# EAGLE schematic HotFire_BreakoutBoard (EAGLE 9.0.1)
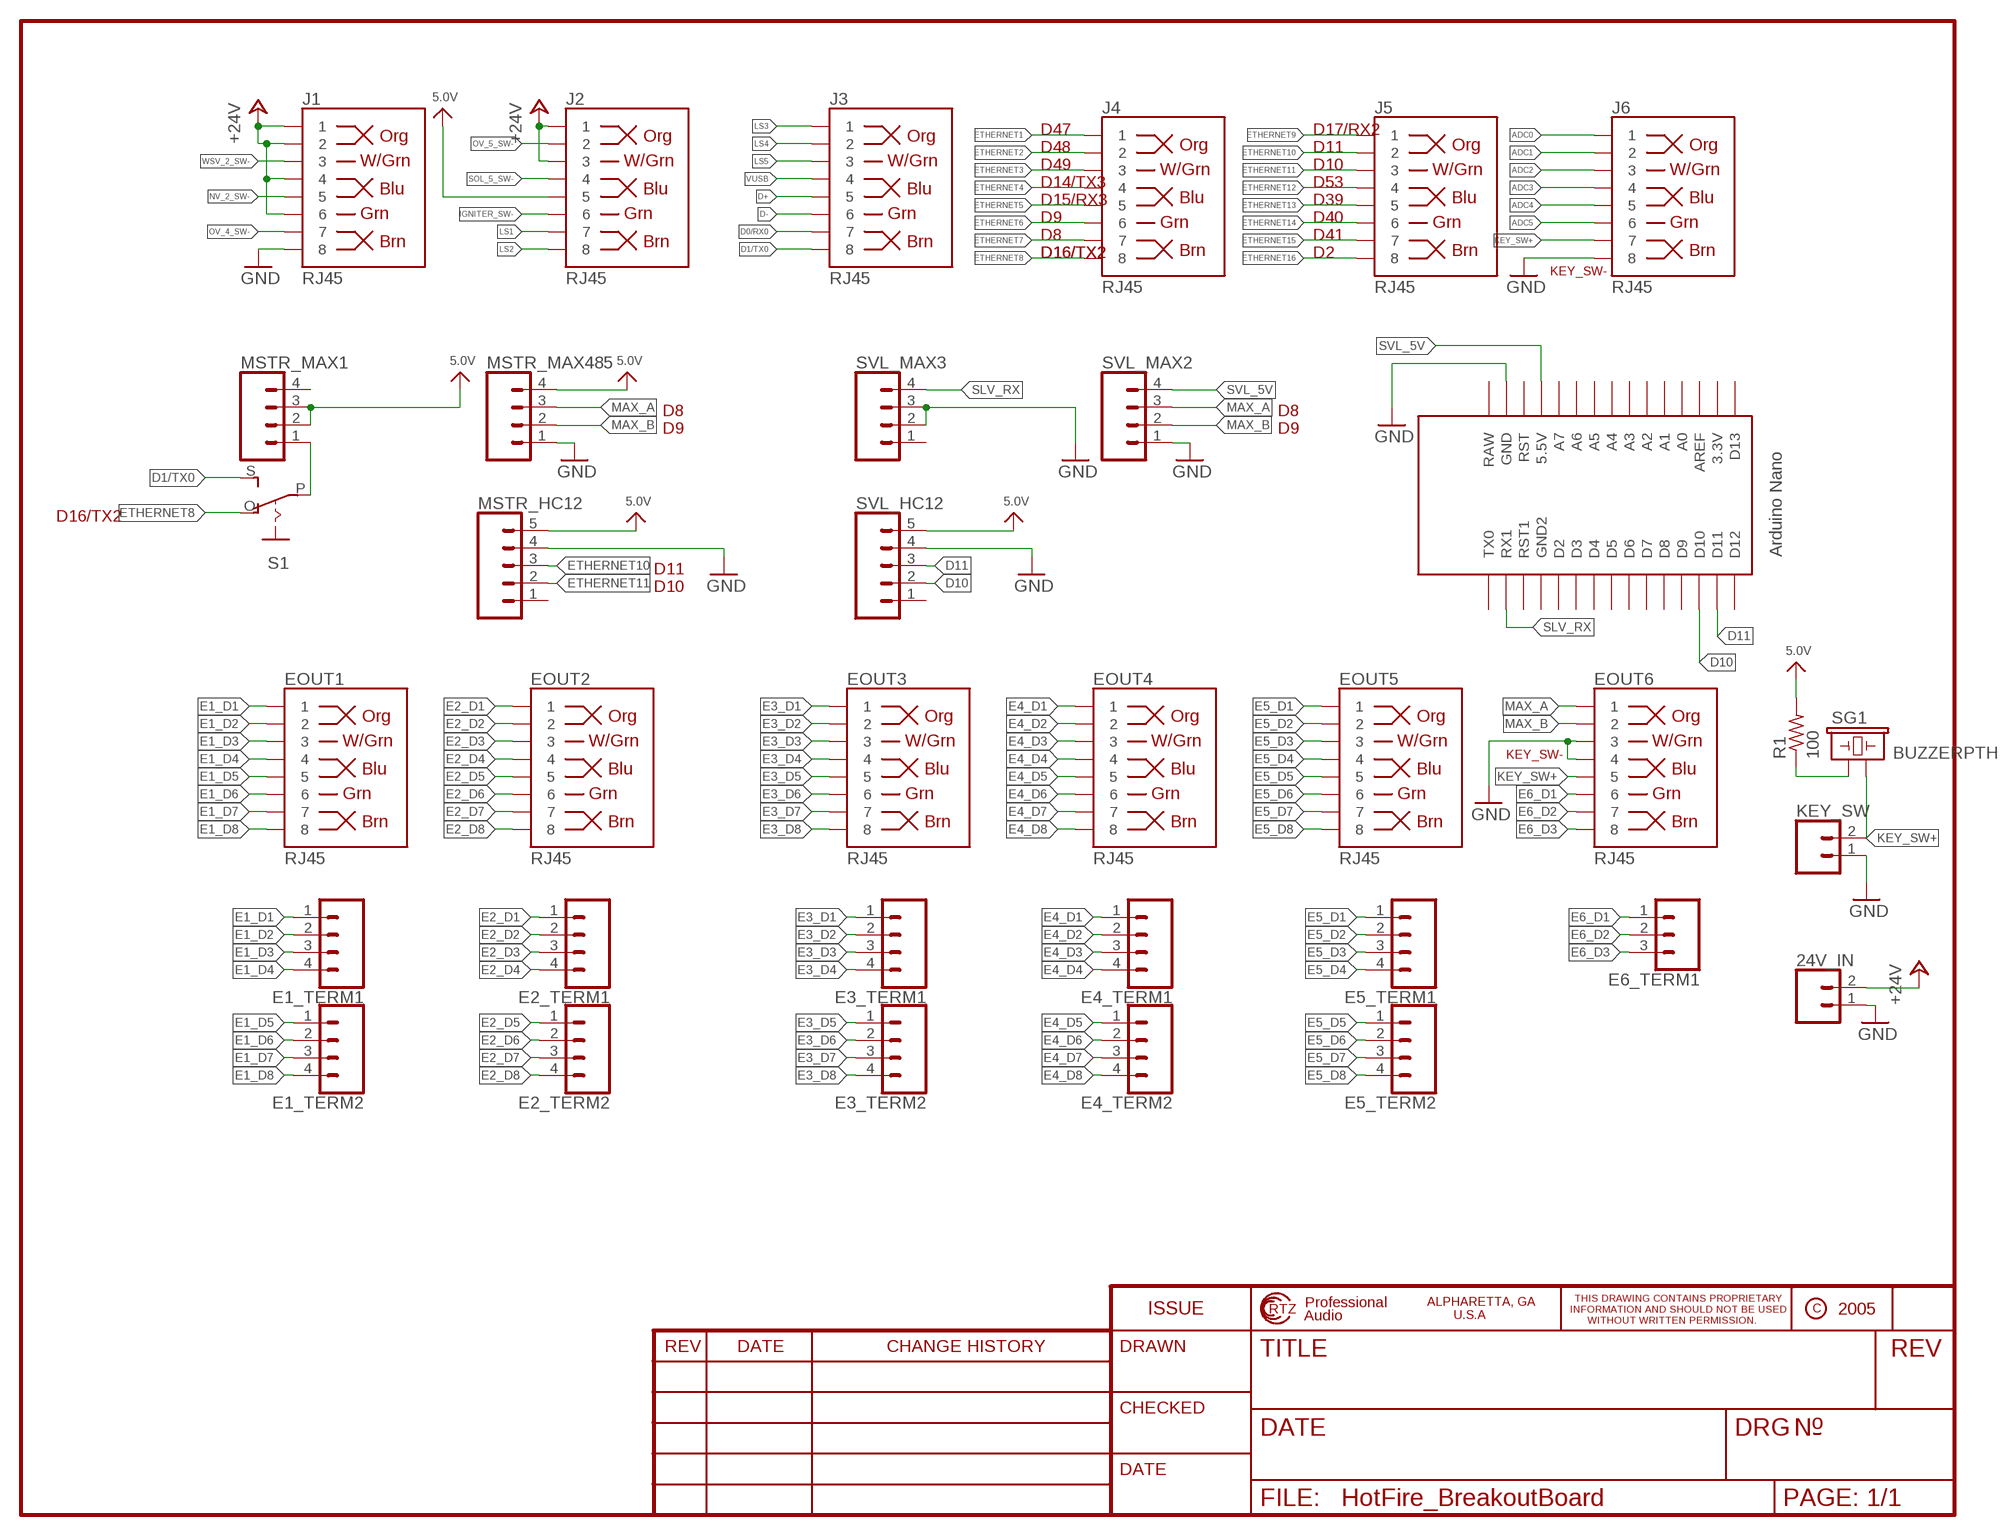
[diagram p0: schematic, sheet 1]

## Parts
24V_IN  CONN_023.5MM  [SCREWTERMINAL-3.5MM-2]
E1_TERM1  CONN_04SCREW  [SCREWTERMINAL-3.5MM-4]
E1_TERM2  CONN_04SCREW  [SCREWTERMINAL-3.5MM-4]
E2_TERM1  CONN_04SCREW  [SCREWTERMINAL-3.5MM-4]
E2_TERM2  CONN_04SCREW  [SCREWTERMINAL-3.5MM-4]
E3_TERM1  CONN_04SCREW  [SCREWTERMINAL-3.5MM-4]
E3_TERM2  CONN_04SCREW  [SCREWTERMINAL-3.5MM-4]
E4_TERM1  CONN_04SCREW  [SCREWTERMINAL-3.5MM-4]
E4_TERM2  CONN_04SCREW  [SCREWTERMINAL-3.5MM-4]
E5_TERM1  CONN_04SCREW  [SCREWTERMINAL-3.5MM-4]
E5_TERM2  CONN_04SCREW  [SCREWTERMINAL-3.5MM-4]
E6_TERM1  CONN_03SCREW  [SCREWTERMINAL-3.5MM-3]
EOUT1  RJ45  RJ45-8  [RJ45-8]
EOUT2  RJ45  RJ45-8  [RJ45-8]
EOUT3  RJ45  RJ45-8  [RJ45-8]
EOUT4  RJ45  RJ45-8  [RJ45-8]
EOUT5  RJ45  RJ45-8  [RJ45-8]
EOUT6  RJ45  RJ45-8  [RJ45-8]
J1  RJ45  RJ45-8  [RJ45-8]
J2  RJ45  RJ45-8  [RJ45-8]
J3  RJ45  RJ45-8  [RJ45-8]
J4  RJ45  RJ45-8  [RJ45-8]
J5  RJ45  RJ45-8  [RJ45-8]
J6  RJ45  RJ45-8  [RJ45-8]
KEY_SW  CONN_023.5MM  [SCREWTERMINAL-3.5MM-2]
MSTR_HC12  CONN_05  [1X05]
MSTR_MAX1  CONN_04  [1X04]
MSTR_MAX485  CONN_04  [1X04]
R1  100  R-US_R0805  [R0805]
S1  EG1218S  [EG1218]
SG1  BUZZERPTH  [BUZZER-12MM]
SVL_HC12  CONN_05  [1X05]
SVL_MAX2  CONN_04  [1X04]
SVL_MAX3  CONN_04  [1X04]
U$4  NANO  [NANO]

## Nets
5.0V [16mil]: J2.5 MSTR_HC12.5 MSTR_MAX1.2 MSTR_MAX1.3 MSTR_MAX485.4 R1.2 SVL_HC12.5
+24V [24mil]: 24V_IN.2 J1.1 J1.2 J1.4 J1.6 J2.1 J2.3
ADC0: J6.1
ADC1: J6.2
ADC2: J6.3
ADC3: J6.4
ADC4: J6.5
ADC5: J6.6
D0/RX0: J3.7
D1/TX0: J3.8 S1.S
D10: SVL_HC12.2 U$4.D10
D11: SVL_HC12.3 U$4.D11
D+: J3.5
D-: J3.6
E1_D1: E1_TERM1.1 EOUT1.1
E1_D2: E1_TERM1.2 EOUT1.2
E1_D3: E1_TERM1.3 EOUT1.3
E1_D4: E1_TERM1.4 EOUT1.4
E1_D5: E1_TERM2.1 EOUT1.5
E1_D6: E1_TERM2.2 EOUT1.6
E1_D7: E1_TERM2.3 EOUT1.7
E1_D8: E1_TERM2.4 EOUT1.8
E2_D1: E2_TERM1.1 EOUT2.1
E2_D2: E2_TERM1.2 EOUT2.2
E2_D3: E2_TERM1.3 EOUT2.3
E2_D4: E2_TERM1.4 EOUT2.4
E2_D5: E2_TERM2.1 EOUT2.5
E2_D6: E2_TERM2.2 EOUT2.6
E2_D7: E2_TERM2.3 EOUT2.7
E2_D8: E2_TERM2.4 EOUT2.8
E3_D1: E3_TERM1.1 EOUT3.1
E3_D2: E3_TERM1.2 EOUT3.2
E3_D3: E3_TERM1.3 EOUT3.3
E3_D4: E3_TERM1.4 EOUT3.4
E3_D5: E3_TERM2.1 EOUT3.5
E3_D6: E3_TERM2.2 EOUT3.6
E3_D7: E3_TERM2.3 EOUT3.7
E3_D8: E3_TERM2.4 EOUT3.8
E4_D1: E4_TERM1.1 EOUT4.1
E4_D2: E4_TERM1.2 EOUT4.2
E4_D3: E4_TERM1.3 EOUT4.3
E4_D4: E4_TERM1.4 EOUT4.4
E4_D5: E4_TERM2.1 EOUT4.5
E4_D6: E4_TERM2.2 EOUT4.6
E4_D7: E4_TERM2.3 EOUT4.7
E4_D8: E4_TERM2.4 EOUT4.8
E5_D1: E5_TERM1.1 EOUT5.1
E5_D2: E5_TERM1.2 EOUT5.2
E5_D3: E5_TERM1.3 EOUT5.3
E5_D4: E5_TERM1.4 EOUT5.4
E5_D5: E5_TERM2.1 EOUT5.5
E5_D6: E5_TERM2.2 EOUT5.6
E5_D7: E5_TERM2.3 EOUT5.7
E5_D8: E5_TERM2.4 EOUT5.8
E6_D1: E6_TERM1.1 EOUT6.6
E6_D2: E6_TERM1.2 EOUT6.7
E6_D3: E6_TERM1.3 EOUT6.8
ETHERNET1: J4.1
ETHERNET2: J4.2
ETHERNET3: J4.3
ETHERNET4: J4.4
ETHERNET5: J4.5
ETHERNET6: J4.6
ETHERNET7: J4.7
ETHERNET8: J4.8 S1.O
ETHERNET9: J5.1
ETHERNET10: J5.2 MSTR_HC12.3
ETHERNET11: J5.3 MSTR_HC12.2
ETHERNET12: J5.4
ETHERNET13: J5.5
ETHERNET14: J5.6
ETHERNET15: J5.7
ETHERNET16: J5.8
GND [32mil]: 24V_IN.1 EOUT6.3 EOUT6.4 J1.8 J6.8 KEY_SW.1 MSTR_HC12.4 MSTR_MAX485.1 SVL_HC12.4 SVL_MAX2.1 SVL_MAX3.2 SVL_MAX3.3 U$4.GND
IGNITER_SW- [32mil]: J2.6
KEY_SW+ [32mil]: EOUT6.5 J6.7 KEY_SW.2 SG1.-
LS1: J2.7
LS2: J2.8
LS3: J3.1
LS4: J3.2
LS5: J3.3
MAX_A: EOUT6.1 MSTR_MAX485.3 SVL_MAX2.3
MAX_B: EOUT6.2 MSTR_MAX485.2 SVL_MAX2.2
N$1: MSTR_MAX1.1 S1.P
N$5 [16mil]: R1.1 SG1.+
NV_2_SW- [24mil]: J1.5
OV_4_SW- [24mil]: J1.7
OV_5_SW- [24mil]: J2.2
SLV_RX: SVL_MAX3.4 U$4.RX1
SOL_5_SW- [24mil]: J2.4
SVL_5V: SVL_MAX2.4 U$4.5V(5.5V)
VUSB [16mil]: J3.4
WSV_2_SW- [24mil]: J1.3
Unconnected: MSTR_HC12.1 MSTR_MAX1.4 SVL_HC12.1 SVL_MAX3.1 U$4.3.3V U$4.A0 U$4.A1 U$4.A2 U$4.A3 U$4.A4 U$4.A5 U$4.A6 U$4.A7 U$4.AREF U$4.D2 U$4.D3 U$4.D4 U$4.D5 U$4.D6 U$4.D7 U$4.D8 U$4.D9 U$4.D12 U$4.D13 U$4.GND1(GND2) U$4.ICSP1 U$4.ICSP2 U$4.ICSP3 U$4.ICSP4 U$4.ICSP5 U$4.ICSP6 U$4.RAW U$4.RST U$4.RST1 U$4.TX0

## Notes on the sheet
- D47 | D17/RX2
- D48 | D11
- D49 | D10
- D14/TX3 | D53
- D15/RX3 | D39
- D9 | D40
- D8 | D41
- D16/TX2 | D16/TX2 | D2
- KEY_SW-
- D8 | D8
- D9 | D9
- D16/TX2
- D11
- D10
- KEY_SW-

## Library data of the parts
24V_IN KEY_SW = SparkFun-Connectors:CONN_02: Multi connection point. Often used as Generic Header-pin footprint for 0.1 inch spaced/style header connections On any of the 0.1 inch spaced packages, you can populate with these: Break Away Headers - Straight <https://www.sparkfun.com/products/116> (PRT-00116) Break Away Male Headers - Right Angle <https://www.sparkfun.com/products/553> (PRT-00553) Female Headers <https://www.sparkfun.com/products/115> (PRT-00115) Break Away Headers - Machine Pin <https://www.sparkfun.com/products/117> (PRT-00117) Break Away Female Headers - Swiss Machine Pin <https://www.sparkfun.com/products/743> (PRT-00743) For SCREWTERMINALS and SPRING TERMINALS visit here: Screw Terimnals on SparkFun.com <https://www.sparkfun.com/search/results?term=Screw+Terminals> (5mm/3.5mm/2.54mm spacing) This device is also useful as a general connection point to wire up your design to another part of your project. Our various solder wires solder well into these plated through hole pads. Hook-Up Wire - Assortment (Stranded, 22 AWG) <https://www.sparkfun.com/products/11375> (PRT-11375) Hook-Up Wire - Assortment (Solid Core, 22 AWG) <https://www.sparkfun.com/products/11367> (PRT-11367) View the entire wire category on our website here <https://www.sparkfun.com/categories/141> Special notes: Molex polarized connector foot print use with: PRT-08233 with associated crimp pins and housings. 2.54_SCREWTERM for use with PRT-10571. 3.5mm Screw Terminal footprints for PRT-08084 5mm Screw Terminal footprints for use with PRT-08432; PROD_ID: CONN-08399
E1_TERM1 E1_TERM2 E2_TERM1 E2_TERM2 E3_TERM1 E3_TERM2 E4_TERM1 E4_TERM2 E5_TERM1 E5_TERM2 = SparkFun-Connectors:CONN_04: Multi connection point. Often used as Generic Header-pin footprint for 0.1 inch spaced/style header connections On any of the 0.1 inch spaced packages, you can populate with these: Break Away Headers - Straight <https://www.sparkfun.com/products/116> (PRT-00116) Break Away Male Headers - Right Angle <https://www.sparkfun.com/products/553> (PRT-00553) Female Headers <https://www.sparkfun.com/products/115> (PRT-00115) Break Away Headers - Machine Pin <https://www.sparkfun.com/products/117> (PRT-00117) Break Away Female Headers - Swiss Machine Pin <https://www.sparkfun.com/products/743> (PRT-00743) For SCREWTERMINALS and SPRING TERMINALS visit here: Screw Terimnals on SparkFun.com <https://www.sparkfun.com/search/results?term=Screw+Terminals> (5mm/3.5mm/2.54mm spacing) This device is also useful as a general connection point to wire up your design to another part of your project. Our various solder wires solder well into these plated through hole pads. Hook-Up Wire - Assortment (Stranded, 22 AWG) <https://www.sparkfun.com/products/11375> (PRT-11375) Hook-Up Wire - Assortment (Solid Core, 22 AWG) <https://www.sparkfun.com/products/11367> (PRT-11367) View the entire wire category on our website here <https://www.sparkfun.com/categories/141> Special notes: Molex polarized connector foot print use with SKU : PRT-08231 with associated crimp pins and housings. 1MM SMD Version SKU: PRT-10208; PROD_ID: 2xCONN-08399; SF_ID: 2xPRT-08084
E6_TERM1 = SparkFun-Connectors:CONN_03: Multi connection point. Often used as Generic Header-pin footprint for 0.1 inch spaced/style header connections On any of the 0.1 inch spaced packages, you can populate with these: Break Away Headers - Straight <https://www.sparkfun.com/products/116> (PRT-00116) Break Away Male Headers - Right Angle <https://www.sparkfun.com/products/553> (PRT-00553) Female Headers <https://www.sparkfun.com/products/115> (PRT-00115) Break Away Headers - Machine Pin <https://www.sparkfun.com/products/117> (PRT-00117) Break Away Female Headers - Swiss Machine Pin <https://www.sparkfun.com/products/743> (PRT-00743) Stackable Header - 3 Pin (Female, 0.1") <https://www.sparkfun.com/products/13875> (PRT-13875) For SCREWTERMINALS and SPRING TERMINALS visit here: Screw Terimnals on SparkFun.com <https://www.sparkfun.com/search/results?term=Screw+Terminals> (5mm/3.5mm/2.54mm spacing) This device is also useful as a general connection point to wire up your design to another part of your project. Our various solder wires solder well into these plated through hole pads. Hook-Up Wire - Assortment (Stranded, 22 AWG) <https://www.sparkfun.com/products/11375> (PRT-11375) Hook-Up Wire - Assortment (Solid Core, 22 AWG) <https://www.sparkfun.com/products/11367> (PRT-11367) View the entire wire category on our website here <https://www.sparkfun.com/categories/141> Special notes: Molex polarized connector foot print use with SKU : PRT-08232 with associated crimp pins and housings.; PROD_ID: CONN-08288; SF_ID: PRT-08235
EOUT1-EOUT6 J1-J6 = SparkFun-Connectors:RJ45-8: RJ45 Jack - 8 pin Simple RJ45, 8-pin connection. Commonly used for Cat5, Cat5e, and Cat6 Ethernet cables. Here is the connector we sell at SparkFun: RJ45 8-Pin Connector <https://www.sparkfun.com/products/643> (PRT-00643) Datasheet <https://cdn.sparkfun.com/datasheets/Prototyping/04908.pdf> It is used on this SparkFun product: SparkFun RJ45 Breakout <https://www.sparkfun.com/products/716> (BOB-00716) Note, you may also be interested in the "MAGJACK" version of this. It is basically a RJ45 connector, but also has some status LEDs built into the connector housing. You can check that out in this library at the device named "MAGJACK.dev" and see these products online: RJ45 Ethernet MagJack-Compatible <https://www.sparkfun.com/products/8534> (PRT-08534) SparkFun RJ45 MagJack Breakout <https://www.sparkfun.com/products/13021> (BOB-13021); PROD_ID: CONN-08506; SF_ID: PRT-00643
MSTR_HC12 SVL_HC12 = SparkFun-Connectors:CONN_05: Multi connection point. Often used as Generic Header-pin footprint for 0.1 inch spaced/style header connections On any of the 0.1 inch spaced packages, you can populate with these: Break Away Headers - Straight <https://www.sparkfun.com/products/116> (PRT-00116) Break Away Male Headers - Right Angle <https://www.sparkfun.com/products/553> (PRT-00553) Female Headers <https://www.sparkfun.com/products/115> (PRT-00115) Break Away Headers - Machine Pin <https://www.sparkfun.com/products/117> (PRT-00117) Break Away Female Headers - Swiss Machine Pin <https://www.sparkfun.com/products/743> (PRT-00743) For SCREWTERMINALS and SPRING TERMINALS visit here: Screw Terimnals on SparkFun.com <https://www.sparkfun.com/search/results?term=Screw+Terminals> (5mm/3.5mm/2.54mm spacing) This device is also useful as a general connection point to wire up your design to another part of your project. Our various solder wires solder well into these plated through hole pads. Hook-Up Wire - Assortment (Stranded, 22 AWG) <https://www.sparkfun.com/products/11375> (PRT-11375) Hook-Up Wire - Assortment (Solid Core, 22 AWG) <https://www.sparkfun.com/products/11367> (PRT-11367) View the entire wire category on our website here <https://www.sparkfun.com/categories/141> Special notes: Molex polarized connector foot print use with SKU : PRT-08231 with associated crimp pins and housings. 1MM SMD Version SKU: PRT-10208
MSTR_MAX1 MSTR_MAX485 SVL_MAX2 SVL_MAX3 = SparkFun-Connectors:CONN_04: Multi connection point. Often used as Generic Header-pin footprint for 0.1 inch spaced/style header connections On any of the 0.1 inch spaced packages, you can populate with these: Break Away Headers - Straight <https://www.sparkfun.com/products/116> (PRT-00116) Break Away Male Headers - Right Angle <https://www.sparkfun.com/products/553> (PRT-00553) Female Headers <https://www.sparkfun.com/products/115> (PRT-00115) Break Away Headers - Machine Pin <https://www.sparkfun.com/products/117> (PRT-00117) Break Away Female Headers - Swiss Machine Pin <https://www.sparkfun.com/products/743> (PRT-00743) For SCREWTERMINALS and SPRING TERMINALS visit here: Screw Terimnals on SparkFun.com <https://www.sparkfun.com/search/results?term=Screw+Terminals> (5mm/3.5mm/2.54mm spacing) This device is also useful as a general connection point to wire up your design to another part of your project. Our various solder wires solder well into these plated through hole pads. Hook-Up Wire - Assortment (Stranded, 22 AWG) <https://www.sparkfun.com/products/11375> (PRT-11375) Hook-Up Wire - Assortment (Solid Core, 22 AWG) <https://www.sparkfun.com/products/11367> (PRT-11367) View the entire wire category on our website here <https://www.sparkfun.com/categories/141> Special notes: Molex polarized connector foot print use with SKU : PRT-08231 with associated crimp pins and housings. 1MM SMD Version SKU: PRT-10208; PROD_ID: CONN-09696
R1 = adafruit:R-US_: RESISTOR, American symbol
S1 = adafruit:EG1218: SLIDING SWITCH 0.1" spacing through hole, vertical SPDT slide switch http://www.ladyada.net/library/pcb/eaglelibrary.html
SG1 = SparkFun:BUZZER: Buzzer 12mm Spark Fun Electronics SKU : Comp-Buzzer
U$4 = Arduino-clone:NANO: Arduino Nano

## Net classes
0 default: width 0.203 mm, drill 0.254 mm, clearance 0.127 mm
1 16mil: width 0.254 mm, drill 0.254 mm, clearance 0.127 mm
2 24mil: width 0.254 mm, drill 0.254 mm, clearance 0.127 mm
3 32mil: width 0.254 mm, drill 0.254 mm, clearance 0.127 mm